# EAGLE design untitled (EAGLE 7.2.0)
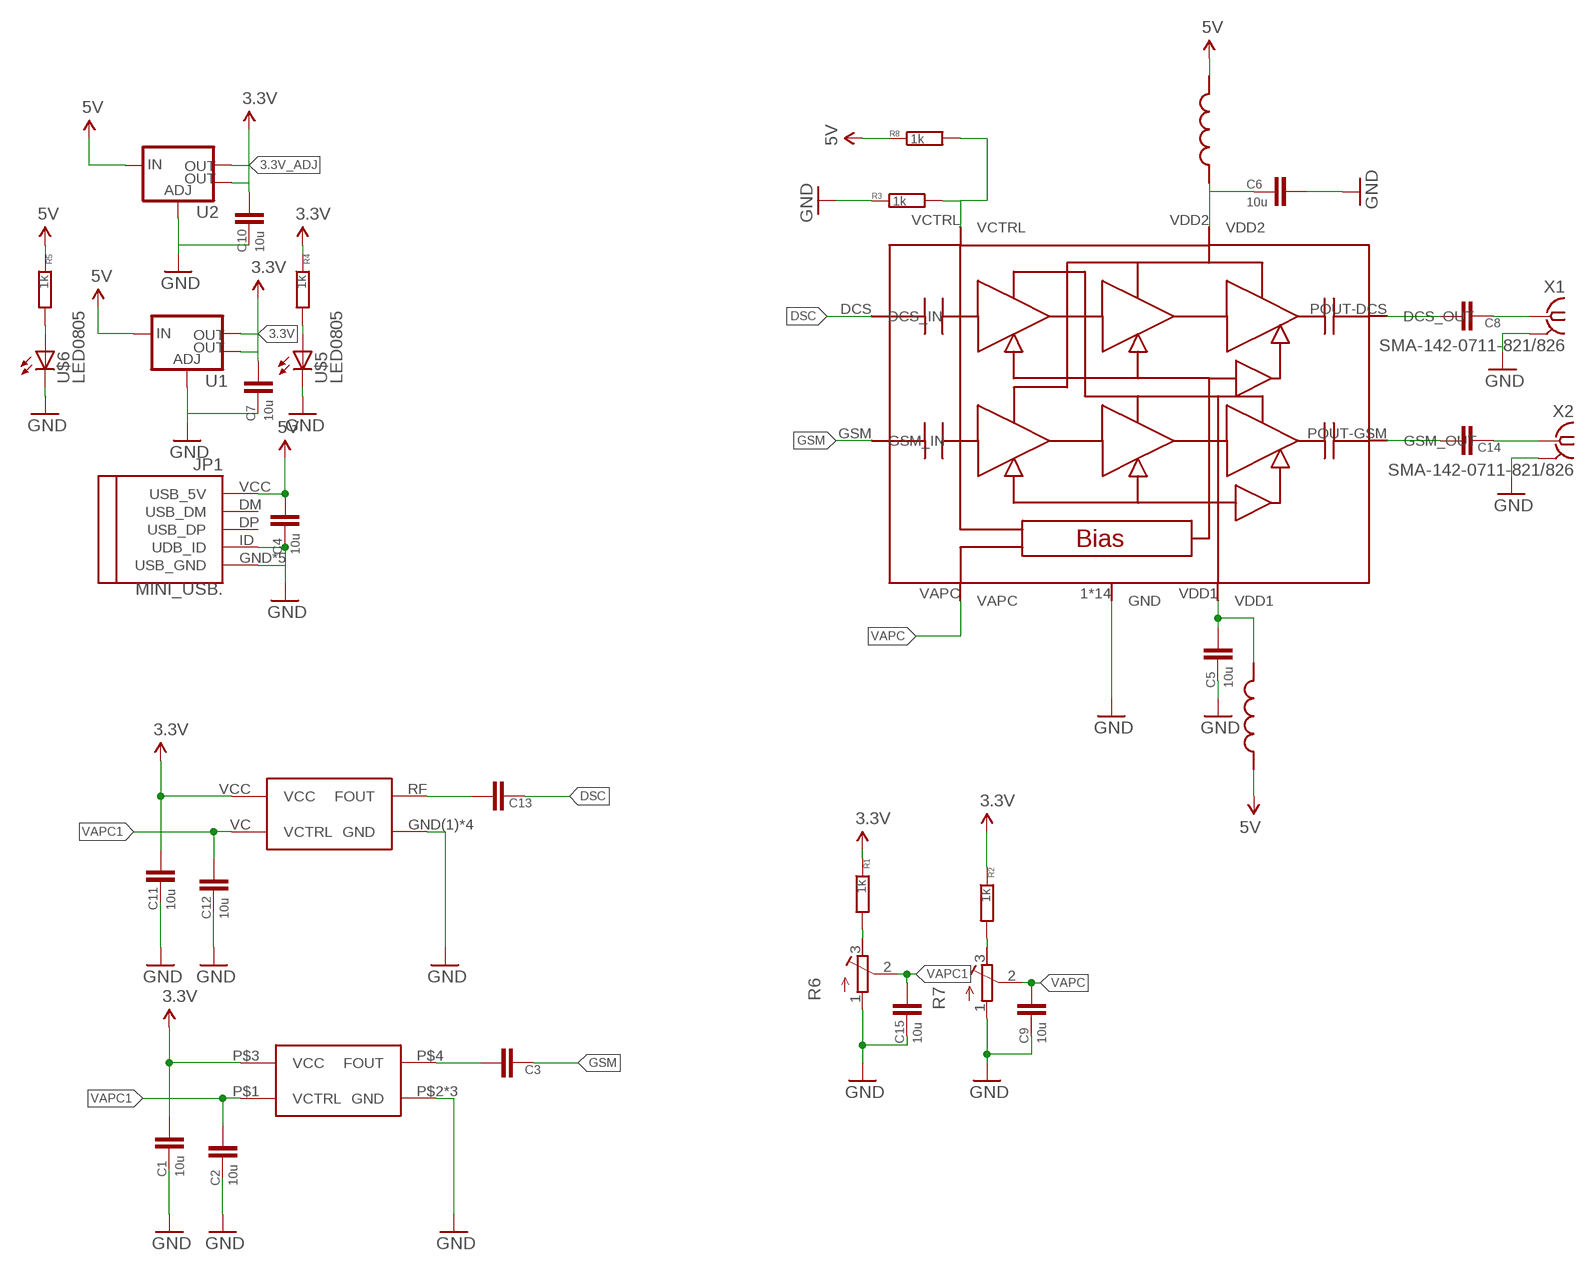
[diagram p0: schematic, sheet 1]

## Parts
C1  10u  CC0805  [C0805]
C2  10u  CC0805  [C0805]
C3  CC0805  [C0805]
C4  10u  CC0805  [C0805]
C5  10u  CC0805  [C0805]
C6  10u  CC0805  [C0805]
C7  10u  CC0805  [C0805]
C8  CC0805  [C0805]
C9  10u  CC0805  [C0805]
C10  10u  CC0805  [C0805]
C11  10u  CC0805  [C0805]
C12  10u  CC0805  [C0805]
C13  CC0805  [C0805]
C14  CC0805  [C0805]
C15  10u  CC0805  [C0805]
JP1  MINI_USB.  [32005-201]
R1  1k  R0603  [0603]
R2  1k  R0603  [0603]
R3  1k  R0603  [0603]
R4  1k  R0603  [0603]
R5  1k  R0603  [0603]
R6  R-TRIMM64W  [RTRIM64W]
R7  R-TRIMM64W  [RTRIM64W]
R8  1k  R0603  [0603]
U1  V_REG_LM1117SOT223  [SOT223]
U2  V_REG_LM1117SOT223  [SOT223]
U$1  FDK_IN089  [FDK_IN_XX]
U$2  RF-K-8A  [RENESAS08123BA]
U$3  L  [L1]
U$4  L  [L1]
U$5  LED0805  [0805-LED]
U$6  LED0805  [0805-LED]
U$7  VCO_RX(1)  [VCO_RX(1)]
X1  SMA-142-0711-821/826  [J502-ND-142-0711-821/826]
X2  SMA-142-0711-821/826  [J502-ND-142-0711-821/826]

## Nets
3.3V: C1.1 C7.1 C11.1 R4.1 U1.2(OUT) U1.4(OUT) U$1.P$3(VCC) U$7.VCC
3.3V_ADJ: C10.1 R1.1 R2.1 U2.2(OUT) U2.4(OUT) ; supply symbol labelled 3.3V
5V: C4.1 JP1.VCC(USB_5V) R5.1 R8.1 U1.3(IN) U2.3(IN) U$3.2 U$4.1
DSC: C13.2 U$2.DCS(DCS_IN)
DSC->: C8.1 U$2.POUT-DCS(DCS_OUT)
GND: C1.2 C2.2 C4.2 C5.2 C6.1 C7.2 C9.2 C10.2 C11.2 C12.2 C15.2 JP1.GND(USB_GND) JP1.ID(UDB_ID) JP1.M1(USB_GND) JP1.M2(USB_GND) JP1.M3(USB_GND) JP1.M4(USB_GND) R3.1 R6.1(A) R7.1(A) U1.1(ADJ) U2.1(ADJ) U$1.P$2(GND) U$1.P$5(GND) U$1.P$6(GND) U$2.1(GND) U$2.2(GND) U$2.3(GND) U$2.4(GND) U$2.5(GND) U$2.6(GND) U$2.7(GND) U$2.8(GND) U$2.9(GND) U$2.10(GND) U$2.11(GND) U$2.12(GND) U$2.13(GND) U$2.14(GND) U$5.C U$6.C U$7.GND(1)(GND) U$7.GND(2)(GND) U$7.GND(3)(GND) U$7.GND(4)(GND) X1.G@1 X1.G@2 X1.G@3 X1.G@4 X2.G@1 X2.G@2 X2.G@3 X2.G@4
GSM: C3.2 U$2.GSM(GSM_IN)
N$1: R1.2 R6.3(E)
N$2: R4.2 U$5.A
N$3: R5.2 U$6.A
N$4: R2.2 R7.3(E)
N$6: C3.1 U$1.P$4(FOUT)
N$7: C8.2 X1.1
N$8: C6.2 U$2.VDD2 U$3.1
N$9: C13.1 U$7.RF(FOUT)
N$10: C14.2 X2.1
N$11: C14.1 U$2.POUT-GSM(GSM_OUT)
N$12: C5.1 U$2.VDD1 U$4.2
VAPC: C9.1 R7.2(S) U$2.VAPC
VAPC1: C2.1 C12.1 C15.1 R6.2(S) U$1.P$1(VCTRL) U$7.VC(VCTRL)
VCTRL: R3.2 R8.2 U$2.VCTRL
Unconnected: JP1.DM(USB_DM) JP1.DP(USB_DP)

## Library data of the parts
C1-C15 = smalsmd:C: Capacitor
JP1 = connectors:MINI_USB
R1-R5 R8 = smalsmd:R
R6 R7 = rcl:R-TRIMM: Trimm resistor
U1 U2 = SparkFun-PowerIC:V_REG_LM1117: Voltage Regulator LM1117 Standard adjustable voltage regulator but in SMD form. Spark Fun Electronics SKU : COM-00595; PROD_ID: VREG-08170
U$1 = vco:FDK_IN089
U$2 = phoneIC:RF-K-8A
U$3 U$4 = smalsmd:L
U$5 U$6 = smalsmd:LED
U$7 = phoneIC:VCO_RX(1)
X1 X2 = con-coax:SMA-: SMA 50 Ohm End Launch Jack Receptacle - Round Contact Johnson Components Source: www.johnsoncomponents.com .. J502-ND.pdf; MF: JOHNSON COMPONENTS; MPN: 142-0711-821; OC_FARNELL: 1019328; OC_NEWARK: 16F3627

## Board
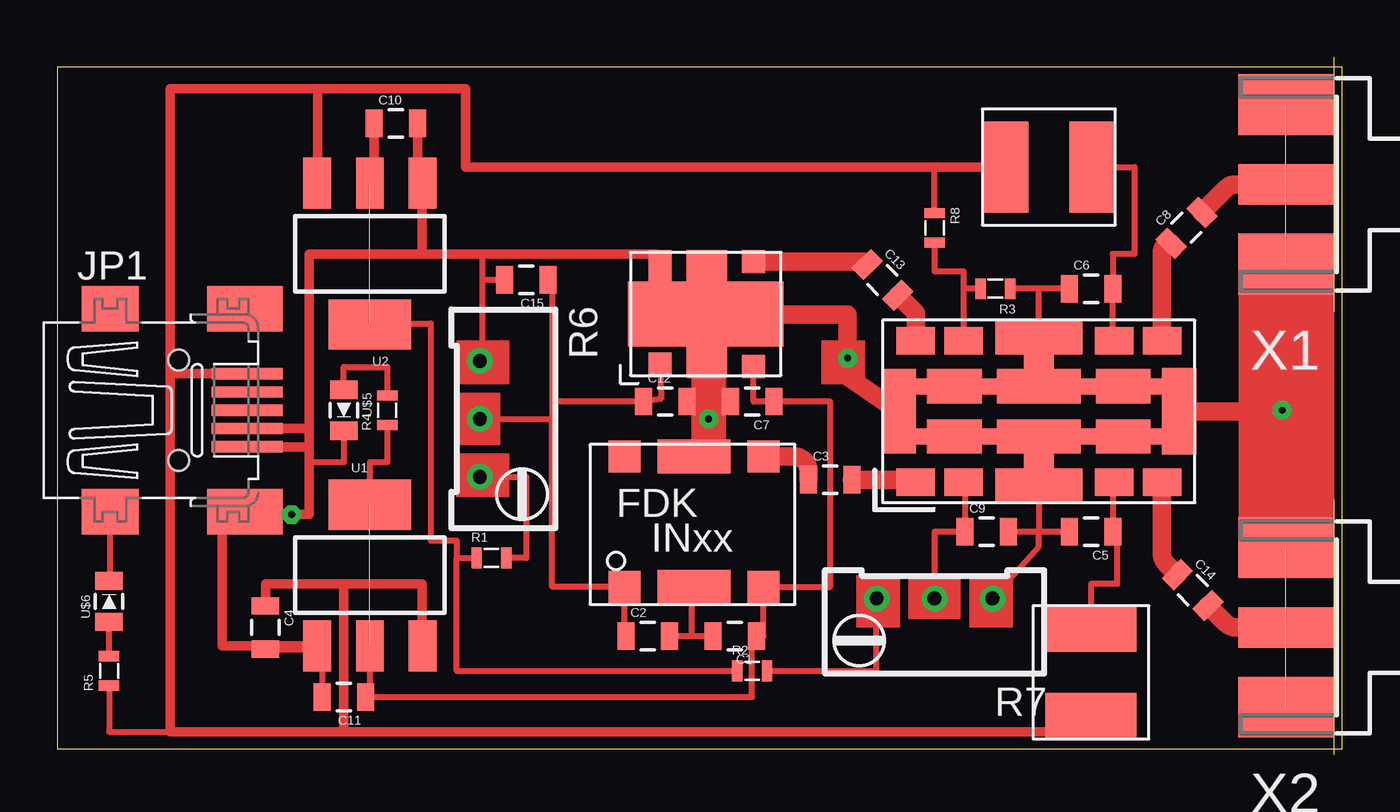
[diagram p1: board, top side]
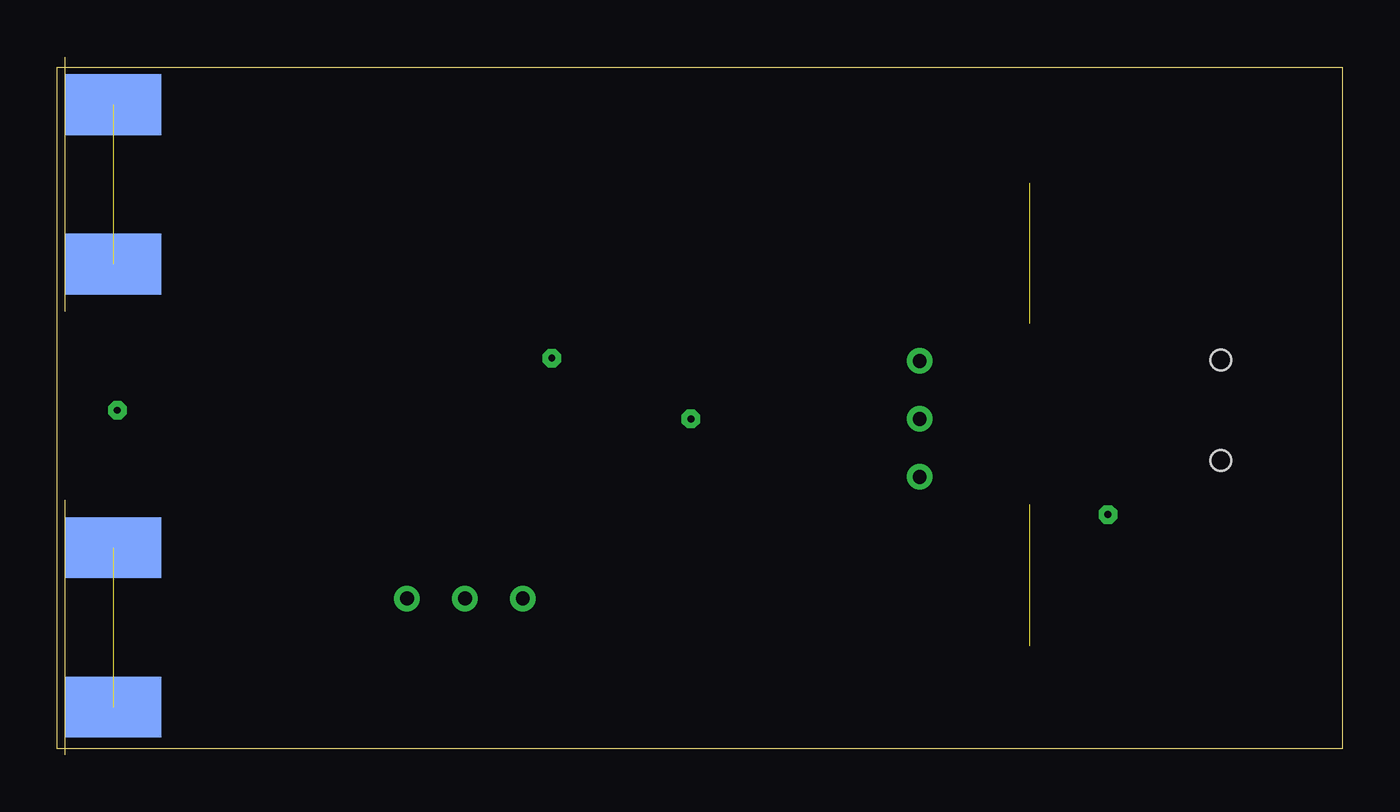
[diagram p2: board, bottom side, seen from below]

Size 56.37 x 29.9 mm. Coordinates in mm from the lower left corner, seen from the top.
Outline: 0,0 56.37,0 56.37,29.9 0,29.9 0,0
Copper layers (1*16): Top 0.035mm / dielectric 1.5mm / Bottom 0.035mm
Design rules "default": minimum track width 0.2mm, minimum drill 0.2mm, track to track 0.2mm, track to pad 0.2mm, pad to pad 0.2mm, via to via 0.2mm, smd to smd 0.2mm, copper to edge 0.2mm, drill to drill 0.2mm, minimum pad ring 10mil, minimum via ring 8mil, stop-mask expansion 4mil, vias tented up to drill 0mil, thermal gap 10mil

### Footprints (pad centres in the part's own frame; a part is rotated, then mirrored left to right if it is on the bottom)
C0805 = smd 0.75 x 1.2: 1 -0.953,0; 2 0.953,0
32005-201 = smd 3.1 x 0.5: DM 3,0.8; DP 3,0; GND 3,-1.6; ID 3,-0.8; VCC 3,1.6 | smd 2.5 x 2: M1 -3,-4.45; M2 -3,4.45 | smd 3.3 x 2: M3 2.9,4.45; M4 2.9,-4.45 | hole 0.9: 0,2.2; 0,-2.2
0603 = smd 0.45 x 0.9: 1 -0.65,0; 2 0.65,0
RTRIM64W = drill 0.61: 1 1.27,-2.54; 2 1.27,0; 3 1.27,2.54
SOT223 = smd 1.219 x 2.235: 1 -2.311,-3.099; 2 0,-3.099; 3 2.311,-3.099 | smd 3.6 x 2.2: 4 0,3.099
FDK_IN_XX = smd 1.4 x 1.4: P$1 1.524,0.762; P$3 7.62,0.762; P$4 7.62,6.477; P$6 1.524,6.477 | smd 3.2 x 1.5: P$2 4.572,0.762; P$5 4.572,6.477
RENESAS08123BA = smd 3.8 x 1.5: 1 0,3.2; 13 0,-3.3 | smd 1.3 x 2: 2 0,2; 7 0,-2.4 | smd 3.7 x 1.5: 3 0,1.05; 8 0,-1.15 | smd 11 x 0.7: 4 -0.05,1.05; 9 0,-1.15 | smd 2.4 x 1.5: 5 -3.7,1.05; 6 -3.7,-1.15; 10 3.7,1.05; 11 3.7,-1.15 | smd 1.5 x 3.8: 12 6.15,-0.05 | smd 1.5 x 3.7: 14 -6.15,-0.05 | smd 1.7 x 1.2: DCS -5.4,3.05; GSM -5.4,-3.15; POUT-DCS 5.4,3.05; POUT-GSM 5.4,-3.15; VAPC -3.3,-3.15; VCTRL -3.3,3.05; VDD1 3.3,-3.15; VDD2 3.3,3.05
L1 = smd 4 x 2: 1 0,1.968; 2 0,-1.841
0805-LED = smd 0.8 x 1.2: A -0.9,0; C 0.9,0
VCO_RX(1) = smd 6.8 x 2.86: GND(1) 3.3,2.7 | smd 1.78 x 5.6: GND(2) 3.35,2.7 | smd 1 x 1: GND(3) 1.3,4.05; GND(4) 1.3,5; RF 5.4,5; VC 1.3,0.5; VCC 5.4,0.4
J502-ND-142-0711-821/826 = smd 4.191 x 1.778: 1 2.115,0 | smd 4.191 x 2.667: G@1 2.115,3.495; G@2 2.115,-3.495 | smd 4.191 x 2.667 bottom: G@3 2.115,3.495; G@4 2.115,-3.495

### Placement (x,y rotation side)
C1  29.72,4.95 180 top
C2  25.91,4.95 0 top
C3  33.91,11.81 0 top
C4  9.14,5.33 270 top
C5  45.34,9.53 180 top
C6  45.34,20.19 0 top
C7  30.48,15.24 180 top
C8  49.53,22.86 45 top
C9  40.77,9.53 0 top
C10  14.86,27.43 0 top
C11  12.57,2.29 180 top
C12  26.67,15.24 0 top
C13  36.2,20.57 315 top
C14  49.8,6.97 315 top
C15  20.57,20.57 180 top
JP1  5.33,14.86 0 top
R1  19.05,8.38 0 top
R2  30.48,3.43 0 top
R3  41.15,20.19 180 top
R4  14.48,14.86 90 top
R5  2.29,3.43 90 top
R6  19.81,14.48 180 top
R7  38.48,5.33 90 top
R8  38.48,22.86 270 top
U1  13.72,7.62 0 top
U2  13.72,21.72 180 top
U$1  23.37,6.35 0 top
U$2  43.05,14.86 0 top
U$3  43.43,25.53 270 top
U$4  45.34,3.43 180 top
U$5  12.57,14.86 270 top
U$6  2.29,6.48 90 top
U$7  25.15,16.38 0 top
X1  56.01,24.77 180 top
X2  56.01,5.33 180 top

### Tracks (layer width: path | path; a pad name or v marks a point on that pad's centre or on a via)
3.3V  (1 unrouted)
  Top 0.254: U1.2 13.72,2.29 C11.1 30.48,2.29 30.48,4.57 30.67,4.57 C1.1 30.99,4.95 U$1.P$3 33.91,7.11 33.91,15.24 C7.1 30.55,15.24 U$7.VCC | R4.1 14.48,12.57 13.72,12.57 U1.4
3.3V_ADJ  (1 unrouted)
  Top 0.254: U2.4 13.72,18.67 16.38,18.67 16.38,9.14 17.53,9.14 17.53,8.38 | 17.53,8.38 R1.1 | 17.53,8.38 17.53,3.43 R2.1
  Top 0.406: U2.2 13.91,24.82 C10.1
5V
  Top 0.254: R5.1 2.29,0.76 5.33,0.76 | R8.1 38.48,25.53 | 46.1,1.52 U$4.1 46.1,0.76
  Top 0.406: JP1.VCC 4.95,16.46 | 4.95,16.46 4.95,0.76 5.33,0.76 12.57,0.76 | 12.57,0.76 46.1,0.76 46.29,0.76 | 11.43,28.96 4.95,28.96 4.95,16.46 | U2.3 11.43,24.82 11.43,28.96 | 12.57,0.76 12.57,7.24 | 12.57,7.24 9.14,7.24 C4.1 | U1.3 16,4.52 16,7.24 12.57,7.24 | 11.43,28.96 17.91,28.96 17.91,25.53 38.48,25.53 U$3.2
DSC
  Top 0.813: C13.2 37.65,19.12 U$2.DCS
DSC->
  Top 0.813: U$2.POUT-DCS 48.45,21.78 arc-90 C8.1
GND  (via drill 0.3 pad 0.81)  (6 unrouted)
  Top 0.254: U$2.1 43.05,20.19 | 43.05,20.19 R3.1 | C6.1 43.05,20.19 | C5.2 43.05,9.53 | 43.05,9.53 C9.2 | U$2.13 43.05,9.53 | 11.67,2.29 C11.2 11.62,4.52 U1.1 11.4,4.38 C4.2 | C2.2 27.81,4.95 | 27.81,4.95 C1.2 | U$1.P$2 27.81,7.11 27.81,4.95 | C12.2 28.57,15.24 | 28.57,15.24 C7.2 | U$7.GND(2) 28.57,18.7 28.57,15.24 | U$1.P$5 27.81,12.83 | 26.45,20.95 U$7.GND(4) 26.45,19.43 26.29,19.43 | U$6.C 2.33,7.38 JP1.M1 | U$5.C 12.57,12.57 11.05,12.57 11.05,12.95 | R6.1 18.67,17.02 18.67,20.57 | 18.67,20.57 18.67,21.72 | C15.2 18.67,20.57 | R7.1 43.05,8.89 43.05,9.53
  Top 0.406: JP1.ID 11.05,14.06 | 11.05,14.06 11.05,13.26 | JP1.GND 11.05,13.26 | U1.1 7.24,4.52 7.24,10.29 8.23,10.29 JP1.M4 | 11.05,13.26 11.05,12.95 11.05,10.29 v10.29,10.29 8.38,10.29 | C10.2 15.81,24.82 U2.1 16,24.82 16,21.72 | 25.53,18.67 25.53,19.43 26.29,19.43 26.29,21.72 18.67,21.72 16,21.72 | 11.05,14.06 11.05,21.72 16,21.72 | U$1.P$5 27.05,12.83 | 28.5,19.05 U$7.GND(2)
  Top 0.813: X1.G@3 53.89,14.81 | 53.89,14.81 U$2.12 | X2.G@2 53.89,14.81 | U$2.14 34.67,16.33 v34.67,17.14 34.67,19.05 28.5,19.05 | U$7.GND(1) arc-90 28.57,18.95 v28.57,14.48 28.57,12.95 27.3,12.95 arc90 U$1.P$5
GSM
  Top 0.813: C3.2 37.37,11.81 U$2.GSM
N$1
  Top 0.254: R6.3 20.57,11.94 20.57,8.38 R1.2
N$2
  Top 0.254: U$5.A 12.57,16.76 14.48,16.76 R4.2
N$3
  Top 0.254: R5.2 U$6.A
N$4
  Top 0.254: R2.2 35.94,3.43 R7.3
N$5  (via drill 0.3 pad 0.81)
  other vias: 53.72,14.86
N$6
  Top 0.813: U$1.P$4 32.32,12.83 arc-90 32.96,12.19 C3.1
N$7
  Top 0.813: C8.2 51.25,24.58 arc-45 51.7,24.77 X1.1
N$8
  Top 0.254: U$3.1 47.24,25.53 47.24,21.72 46.29,21.72 C6.2 46.29,17.91 U$2.VDD2
N$9
  Top 0.813: U$7.RF 35.39,21.38 C13.1
N$10
  Top 0.813: C14.2 51.25,5.52 arc45 51.7,5.33 X2.1
N$11
  Top 0.813: U$2.POUT-GSM 48.45,8.58 arc45 48.64,8.13 C14.1
N$12
  Top 0.254: U$2.VDD1 46.29,11.71 C5.1 46.48,9.53 46.48,7.24 45.34,7.24 U$4.2
VAPC
  Top 0.254: U$2.VAPC 39.81,11.71 C9.1 38.48,9.53 R7.2 37.91,6.6
VAPC1
  Top 0.254: C2.1 24.89,4.95 U$1.P$1 21.72,7.11 21.72,14.48 | U$7.VC 26.48,15.36 C12.1 21.72,15.24 | R6.2 21.72,14.48 | C15.1 21.72,20.57 21.72,15.24 | 21.72,15.24 21.72,14.48
VCTRL
  Top 0.254: R3.2 39.75,20.19 | 39.75,20.19 U$2.VCTRL | R8.2 38.48,20.95 39.75,20.95 39.75,20.19
(copper drawn outside any net)
  shapes: Top area x10